# Altium schematic sheet PrototypeV2.SchDoc
size A4; SheetNumber: 1; SheetTotal: 1
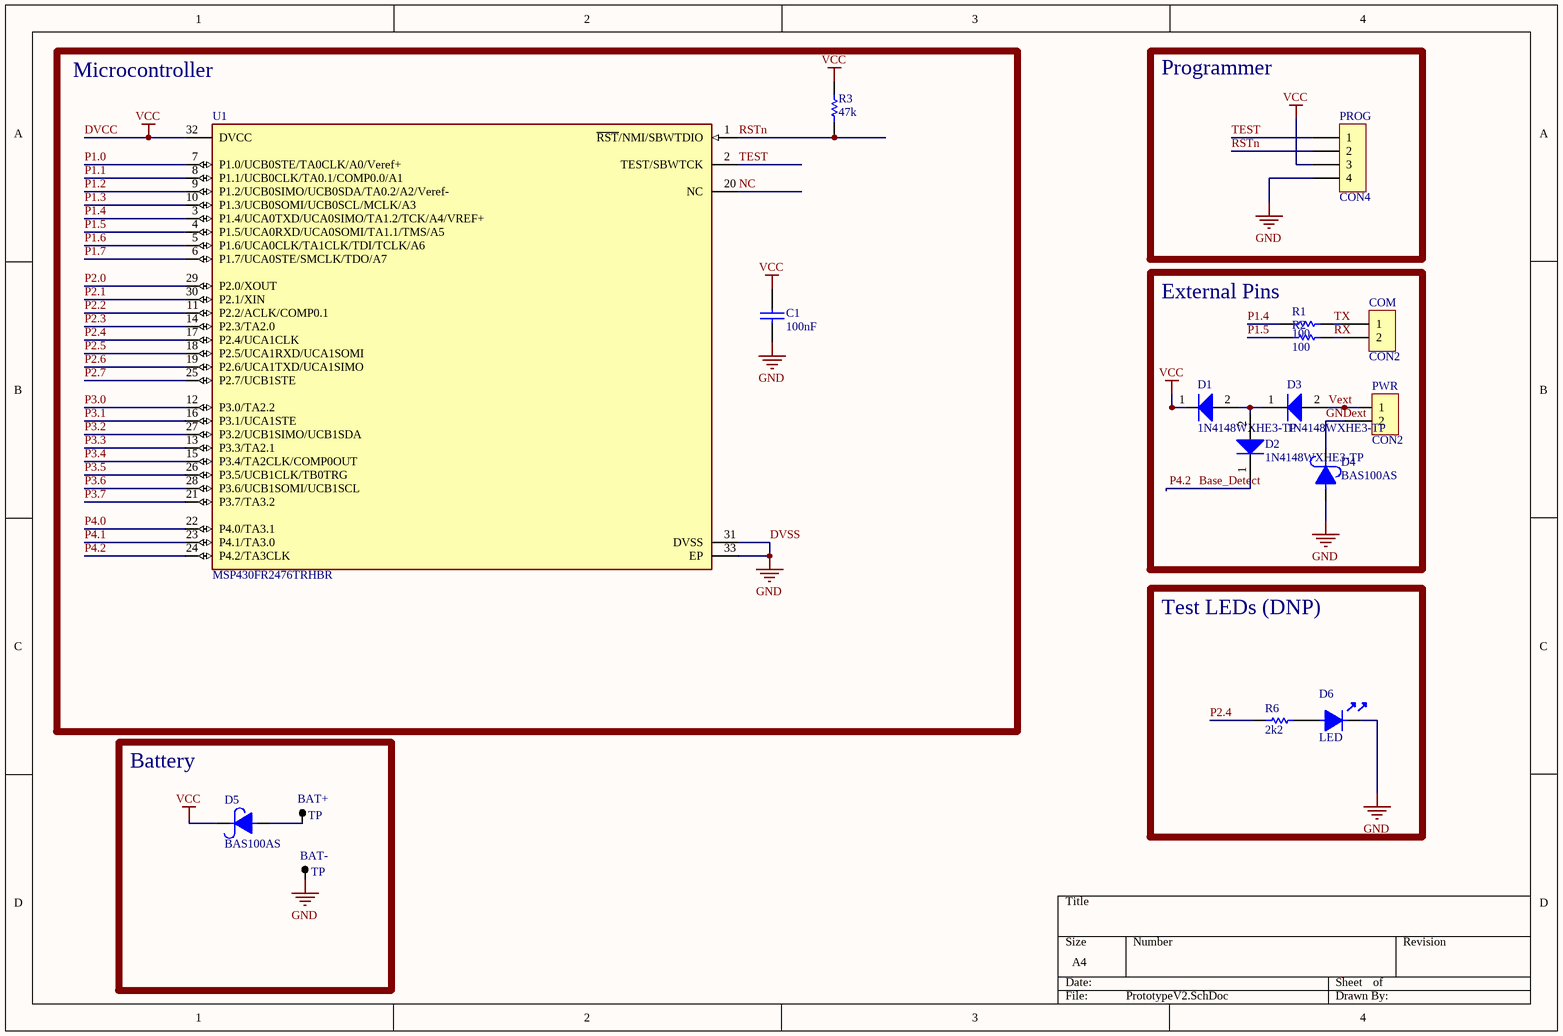
[diagram p0: PrototypeV2.SchDoc]

## Parts
BAT+  TP  [TPTH]
BAT-  TP  [TPTH]
C1  100nF  [0805]
COM  CON2  [SIP2]
D1  1N4148WXHE3-TP  [ONSC-SOD-123-2-425-04_V]
D2  1N4148WXHE3-TP  [ONSC-SOD-123-2-425-04_V]
D3  1N4148WXHE3-TP  [ONSC-SOD-123-2-425-04_V]
D4  BAS100AS  [SODFL350X110-2N]
D5  BAS100AS  [SODFL350X110-2N]
D6  LED  [0805]
PROG  CON4  [SIP4]
PWR  CON2  [SIP2]
R1  100  [0805]
R2  100  [0805]
R3  47k  [0805]
R6  2k2  [0805]
U1  MSP430FR2476TRHBR  [FP-RHB0032E-IPC_A]

## Blocks framed on the sheet
Microcontroller: C1 R3 U1
Programmer: PROG
External Pins: COM D1-D4 PWR R1 R2
Test LEDs (DNP): D6 R6
Battery: BAT+ BAT- D5

## Nets
DVCC: C1.1 D1.1(K) D5.2 PROG.3 R3.1 U1.32(DVCC)  [also labelled VCC]
DVSS: BAT-.1 C1.2 D4.1 D6.2 PROG.4 U1.31(DVSS) U1.33(EP)  [also labelled GND]
Base_Detect: D2.1(K) U1.24(P4.2/TA3CLK)  [also labelled P4.2]
GNDext: D4.2 PWR.2
NC: U1.20(NC)
P1.0: U1.7(P1.0/UCB0STE/TA0CLK/A0/Veref+)
P1.1: U1.8(P1.1/UCB0CLK/TA0.1/COMP0.0/A1)
P1.2: U1.9(P1.2/UCB0SIMO/UCB0SDA/TA0.2/A2/Veref-)
P1.3: U1.10(P1.3/UCB0SOMI/UCB0SCL/MCLK/A3)
P1.4: R1.1 U1.3(P1.4/UCA0TXD/UCA0SIMO/TA1.2/TCK/A4/VREF+)
P1.5: R2.2 U1.4(P1.5/UCA0RXD/UCA0SOMI/TA1.1/TMS/A5)
P1.6: U1.5(P1.6/UCA0CLK/TA1CLK/TDI/TCLK/A6)
P1.7: U1.6(P1.7/UCA0STE/SMCLK/TDO/A7)
P2.0: U1.29(P2.0/XOUT)
P2.1: U1.30(P2.1/XIN)
P2.2: U1.11(P2.2/ACLK/COMP0.1)
P2.3: U1.14(P2.3/TA2.0)
P2.4: R6.2 U1.17(P2.4/UCA1CLK)
P2.5: U1.18(P2.5/UCA1RXD/UCA1SOMI)
P2.6: U1.19(P2.6/UCA1TXD/UCA1SIMO)
P2.7: U1.25(P2.7/UCB1STE)
P3.0: U1.12(P3.0/TA2.2)
P3.1: U1.16(P3.1/UCA1STE)
P3.2: U1.27(P3.2/UCB1SIMO/UCB1SDA)
P3.3: U1.13(P3.3/TA2.1)
P3.4: U1.15(P3.4/TA2CLK/COMP0OUT)
P3.5: U1.26(P3.5/UCB1CLK/TB0TRG)
P3.6: U1.28(P3.6/UCB1SOMI/UCB1SCL)
P3.7: U1.21(P3.7/TA3.2)
P4.0: U1.22(P4.0/TA3.1)
P4.1: U1.23(P4.1/TA3.0)
RSTn: PROG.2 R3.2 U1.1(~{RST}/NMI/SBWTDIO)
RX: COM.2 R2.1
TEST: PROG.1 U1.2(TEST/SBWTCK)
TX: COM.1 R1.2
Vext: D3.2(A) PWR.1
NetBAT+_1: BAT+.1 D5.1
NetD1_2: D1.2(A) D2.2(A) D3.1(K)
NetD6_1: D6.1 R6.1

## Library data of the parts
C1 = CAP
D1-D3 = CMP-0895-00001-2: Switching Diode, 2-Pin SOD-123, Pb-Free, Tape and Reel; PartNumber: MMSD4148T1G; Manufacturer: On Semiconductor; trr Max (ns): 4; IF Max (A): 0.2; Configuration: Single; Mounting Technology: Surface Mount; ComponentLink2URL: http://www.onsemi.com/pub_link/Collateral/MMSD4148T1-D.PDF; ComponentLink1Description: Manufacturer URL; ComponentLink1URL: http://www.onsemi.com/; ComponentLink2Description: Datasheet; PackageDescription: 2-Pin SOD, Body 1.6 x 2.69 mm; Packing: Tape and Reel; DatasheetVersion: Rev. 11; PackageReference: SOD-123-2-425-04; ComponentLink3Description: Package Specification; ComponentLink3URL: http://www.onsemi.com/pub_link/Collateral/425-04.PDF; PackageVersion: Rev. G, 10/2009; RoHS: TRUE
D4 D5 = DIODO SCHOTTKY
R1-R3 R6 = RES
U1 = CMP-04869-000099-1: IC MCU 16BIT 64.5KB FRAM 32VQFN